# Altium project Gould.PrjPCB (part 2 of 2)
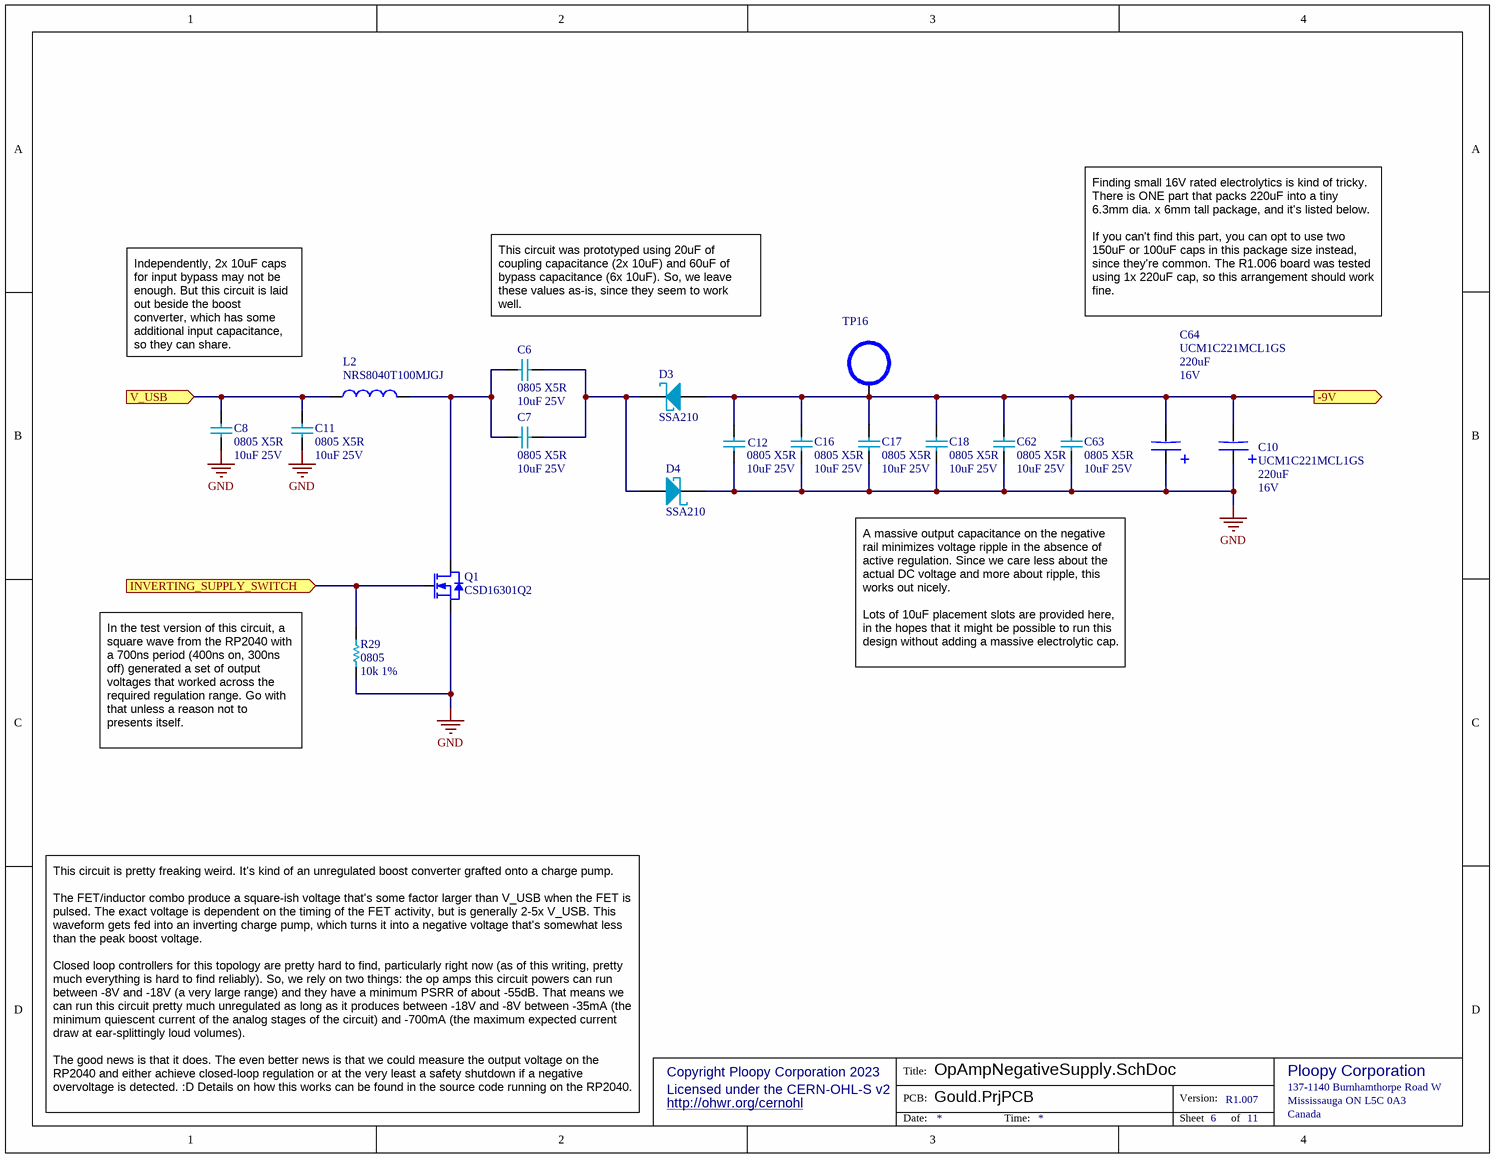
[diagram p11: OpAmpNegativeSupply.SchDoc]

## Assembly variants
BoM: not fitted AML.R.6 AMR.R.6 C13 C15 CON.R.40 CON.R.41 LED.C.21 LED.C.24 LED.C.26 LED.C.28 LED.D.2 LED.D.4 LED.D.6 LED.D.8 LED.R.17 LED.R.19 MCU.C.2 MCU.C.3 MCU.J.1 MCU.J.3 PSL.C.15 PSR.C.15 R?_AML R?_AML R?_AMR R?_AMR REG.C.13 REG.C.15 REG.C.17